# Altium schematic sheet ADC.SchDoc
size A4; DocumentNumber: 5; SheetNumber: 5; SheetTotal: 11
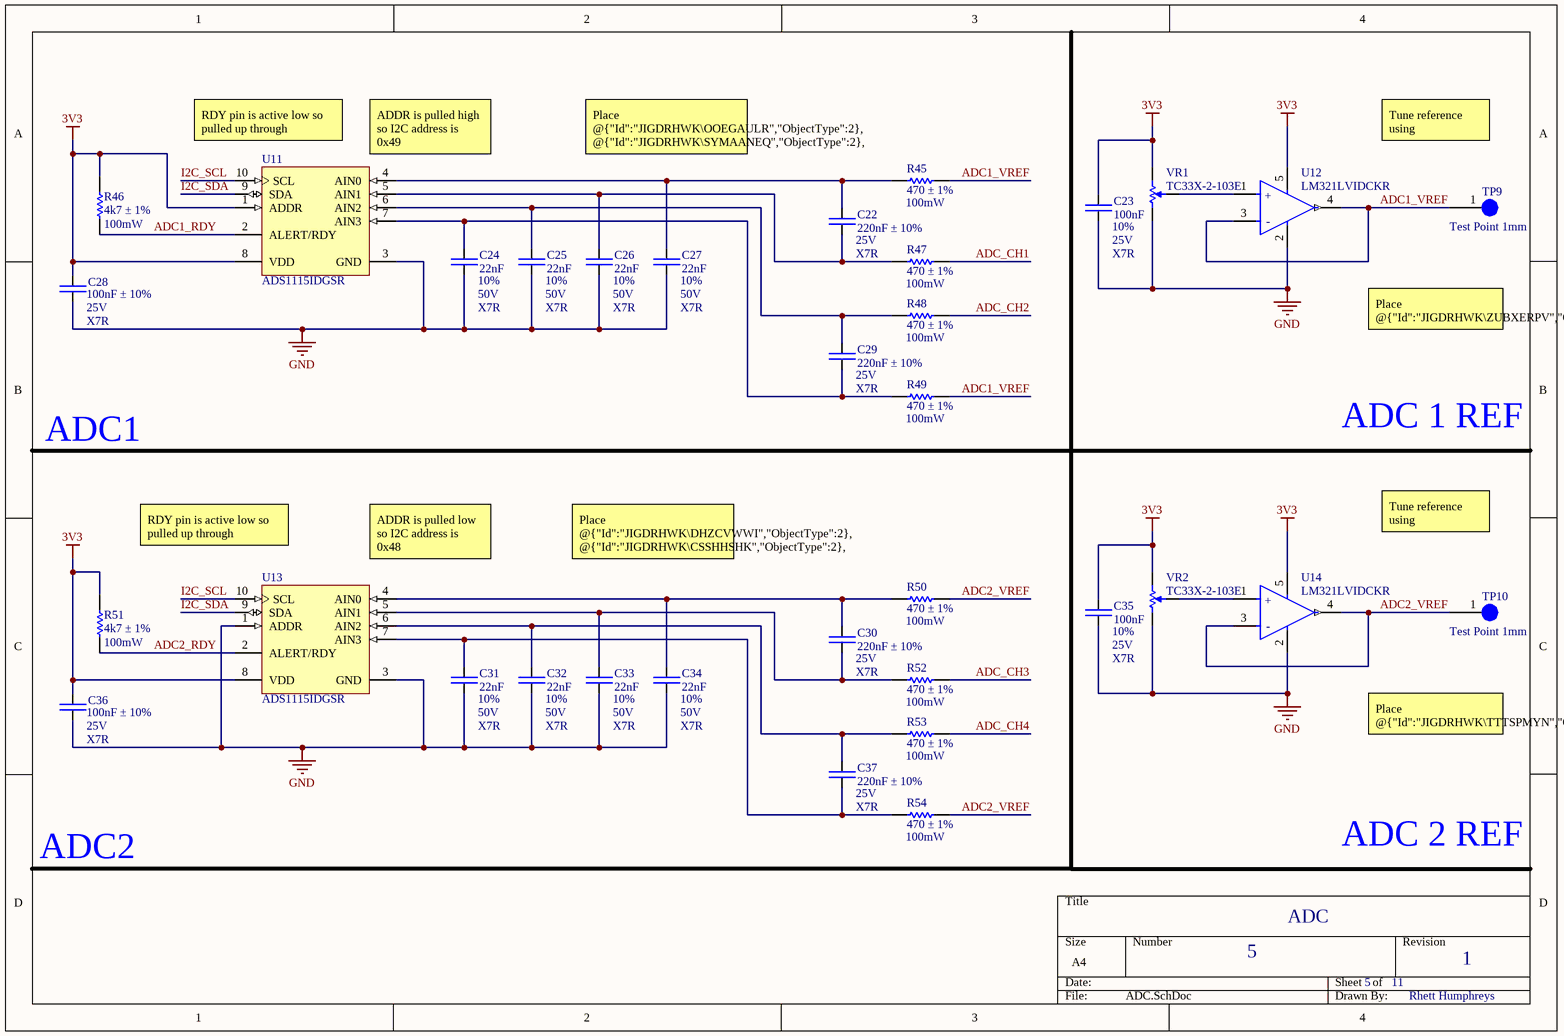
[diagram p0: ADC.SchDoc]

## Parts
C22  220nF ± 10%  [CAP-0603]
C23  100nF  [CAP-0603]
C24  22nF  [CAP-0603]
C25  22nF  [CAP-0603]
C26  22nF  [CAP-0603]
C27  22nF  [CAP-0603]
C28  100nF ± 10%  [CAP-0603]
C29  220nF ± 10%  [CAP-0603]
C30  220nF ± 10%  [CAP-0603]
C31  22nF  [CAP-0603]
C32  22nF  [CAP-0603]
C33  22nF  [CAP-0603]
C34  22nF  [CAP-0603]
C35  100nF  [CAP-0603]
C36  100nF ± 10%  [CAP-0603]
C37  220nF ± 10%  [CAP-0603]
R45  470 ± 1%  [RES-0603]
R46  4k7 ± 1%  [RES-0603]
R47  470 ± 1%  [RES-0603]
R48  470 ± 1%  [RES-0603]
R49  470 ± 1%  [RES-0603]
R50  470 ± 1%  [RES-0603]
R51  4k7 ± 1%  [RES-0603]
R52  470 ± 1%  [RES-0603]
R53  470 ± 1%  [RES-0603]
R54  470 ± 1%  [RES-0603]
TP9  Test Point 1mm  [Test Point 1mm]
TP10  Test Point 1mm  [Test Point 1mm]
U11  ADS1115IDGSR  [TI-DGS10_M]
U12  LM321LVIDCKR  [FP-DCK0005A-IPC_B]
U13  ADS1115IDGSR  [TI-DGS10_M]
U14  LM321LVIDCKR  [FP-DCK0005A-IPC_B]
VR1  TC33X-2-103E  [BOUR-TC33X-2_V]
VR2  TC33X-2-103E  [BOUR-TC33X-2_V]

## Nets
3V3: C23.2 C28.2 C35.2 C36.2 R46.2 R51.2 U11.1(ADDR) U11.8(VDD) U12.5(V+) U13.8(VDD) U14.5(V+) VR1.3 VR2.3
GND: C23.1 C24.1 C25.1 C26.1 C27.1 C28.1 C31.1 C32.1 C33.1 C34.1 C35.1 C36.1 U11.3(GND) U12.2(V-) U13.1(ADDR) U13.3(GND) U14.2(V-) VR1.1 VR2.1
ADC1_RDY: R46.1 U11.2(ALERT/RDY)
ADC1_VREF: R45.1 R49.1 TP9.1 U12.3(IN-) U12.4(OUT)
ADC2_RDY: R51.1 U13.2(ALERT/RDY)
ADC2_VREF: R50.1 R54.1 TP10.1 U14.3(IN-) U14.4(OUT)
ADC_CH1: R47.1
ADC_CH2: R48.1
ADC_CH3: R52.1
ADC_CH4: R53.1
I2C_SCL: U11.10(SCL) U13.10(SCL)
I2C_SDA: U11.9(SDA) U13.9(SDA)
NetC22_1: C22.1 C26.2 R47.2 U11.5(AIN1)
NetC22_2: C22.2 C27.2 R45.2 U11.4(AIN0)
NetC24_2: C24.2 C29.1 R49.2 U11.7(AIN3)
NetC25_2: C25.2 C29.2 R48.2 U11.6(AIN2)
NetC30_1: C30.1 C33.2 R52.2 U13.5(AIN1)
NetC30_2: C30.2 C34.2 R50.2 U13.4(AIN0)
NetC31_2: C31.2 C37.1 R54.2 U13.7(AIN3)
NetC32_2: C32.2 C37.2 R53.2 U13.6(AIN2)
NetU12_1: U12.1(IN+) VR1.2
NetU14_1: U14.1(IN+) VR2.2

## Notes on the sheet
- (near U11) RDY pin is active low so pulled up through @{"Id":"JIGDRHWK\FDMYFDDG","ObjectType":2}
- (near U11) ADDR is pulled high so I2C address is 0x49
- Place @{"Id":"JIGDRHWK\OOEGAULR","ObjectType":2}, @{"Id":"JIGDRHWK\SYMAANEQ","ObjectType":2}, @{"Id":"JIGDRHWK\AAGGNMEF","ObjectType":2}, @{"Id":"JIGDRHWK\UGRZHOXD","ObjectType":2}, @{"Id":"JIGDRHWK\DCBYKJZT","ObjectType":2} as close as possible to @{"Id":"JIGDRHWK\WCYDYSLL","ObjectType":2}
- Tune reference using @{"Id":"JIGDRHWK\DSXTIIZW","ObjectType":2}
- (near R46) 100mW
- (near C22) 25V
- (near R45) 100mW
- (near C23) 10%
- 25V
- (near C28) 25V
- (near C24) 10%
- (near C24) 50V
- X7R
- (near C25) 10%
- (near C25) 50V
- (near C26) 10%
- (near C26) 50V
- (near C27) 10%
- (near C27) 50V
- (near C27) X7R
- 100mW
- (near C28) X7R
- (near C29) 25V
- (near R48) 100mW
- Place @{"Id":"JIGDRHWK\ZUBXERPV","ObjectType":2} as close as possible to @{"Id":"JIGDRHWK\YBGBTBIW","ObjectType":2}
- ADC1
- (near R49) 100mW
- ADC 1 REF
- RDY pin is active low so pulled up through @{"Id":"JIGDRHWK\ISGETNFF","ObjectType":2}
- (near U13) ADDR is pulled low so I2C address is 0x48
- Place @{"Id":"JIGDRHWK\DHZCVWWI","ObjectType":2}, @{"Id":"JIGDRHWK\CSSHHSHK","ObjectType":2}, @{"Id":"JIGDRHWK\WRWKHIOI","ObjectType":2}, @{"Id":"JIGDRHWK\PDEQPWGA","ObjectType":2} and @{"Id":"JIGDRHWK\TQXSGOFX","ObjectType":2} as close as possible to @{"Id":"JIGDRHWK\XZUDINLW","ObjectType":2}
- Tune reference using @{"Id":"JIGDRHWK\HTVWDZPW","ObjectType":2}
- (near R51) 100mW
- (near R50) 100mW
- (near C35) 10%
- (near C31) 10%
- (near C31) 50V
- (near C32) 10%
- (near C32) 50V
- (near C33) 10%
- (near C33) 50V
- (near C34) 10%
- (near C34) 50V
- (near C30) 25V
- (near C36) 25V
- (near C36) X7R
- (near C34) X7R
- (near R53) 100mW
- Place @{"Id":"JIGDRHWK\TTTSPMYN","ObjectType":2} as close as possible to @{"Id":"JIGDRHWK\NQPUVNHB","ObjectType":2}
- (near C37) 25V
- (near R54) 100mW
- ADC 2 REF
- ADC2
- ADC
- 5
- 11
- 1
- Rhett Humphreys
- (in symbol CMP-04895-000147-1) +; -

## Library data of the parts
C22-C37 = CAP-0603: Capacitor chip unpolarized. 0603
R45-R54 = RES-0603: Resistor chip. 0603
U11 U13 = CMP-0003-00378-2: 16-Bit ADC with Integrated Multiplexer, PGA, Comparator, Oscillator, and Reference, -40 to 125 degC, 10-pin SOP (DGS10), Green (RoHS & no Sb/Br); PartNumber: ADS1115IDGST; Manufacturer: Texas Instruments; Sample Rate (max)(SPS): 860; SubFamily: Precision ADC (<=10MSPS); Architecture: Delta-Sigma; Digital Supply(Min)(V): 2; Resolution(Bits): 16; Digital Supply(Max)(V): 5.5; INL(Max)(+/-LSB): 1; Interface: Serial I2C; # Input Channels: 4; Eco-Plan: Green (RoHS & no Sb/Br); PackageDescription: 10-Pin Plastic Small Outline, Body 3 x 3 mm, Pitch 0.5 mm; Mounting Technology: Surface Mount; PackageReference: DGS10; DatasheetVersion: SBAS444B; ComponentLink3Description: Package Specification; ComponentLink1Description: Manufacturer URL; ComponentLink3URL: http://www.ti.com/lit/ml/mpds035b/mpds035b.pdf; ComponentLink2URL: http://www.ti.com/general/docs/lit/getliterature.tsp?genericPartNumber=ADS1115&fileType=pdf; Analog Voltage AV/DD(Min)(V): 2; ComponentLink2Description: Datasheet; PackageVersion: 4073272/C, 02/2004; Analog Voltage AV/DD(Max)(V): 5.5; Code_JEDEC: MO-153; ComponentLink1URL: http://www.ti.com/
U12 U14 = CMP-04895-000147-1: IC OPAMP GP 1 CIRCUIT SC70-5; RoHS Compliant: Yes
VR1 VR2 = CMP-2100-03695-1: Trimming Potentiometer, 10000 Ohm, -40 to 100 degC, 3-Pin SMD, RoHS, Tape and Reel; Manufacturer: Bourns; Tolerance: 25%; Max Power Dissipation: 100mW; Number of Turns: 1; Resistance: 10KOhm; Temperature Coefficient: 250ppm/degreesC; Voltage Rating (DC): 50V; Datasheet URL: http://www.bourns.com/docs/Product-Datasheets/TC33.pdf; Composition: Potentiometer; Package Description: 3-Pin Surface Mount Device, Body 3.8 x 3.6 mm; Weight: 29.4mg; Power Rating: 100mW; Termination: FootPrint; Manufacturer URL: http://www.bourns.com/; Width: 0.118inch; Height: 0.047inch; Military Standard: Not; Radiation Hardening: No; Colour: Silver; Case/Package: SMD/SMT; Depth: 3.8mm; Min Operating Temperature: -40degC; Lead Free: LeadFree; Datasheet Version: 42583.0; REACH SVHC: NoSVHC; Length: 3mm; RoHSCompliant: true; Contact Plating: Silver; Taper: Linear; Packaging: TapeandReel; Mount: SurfaceMount; Max Operating Temperature: 100degC; Package Reference: TC33X-2; Package Quantity: 2500